# EAGLE design PIC24FJ64GB002+BT (EAGLE 6.2)
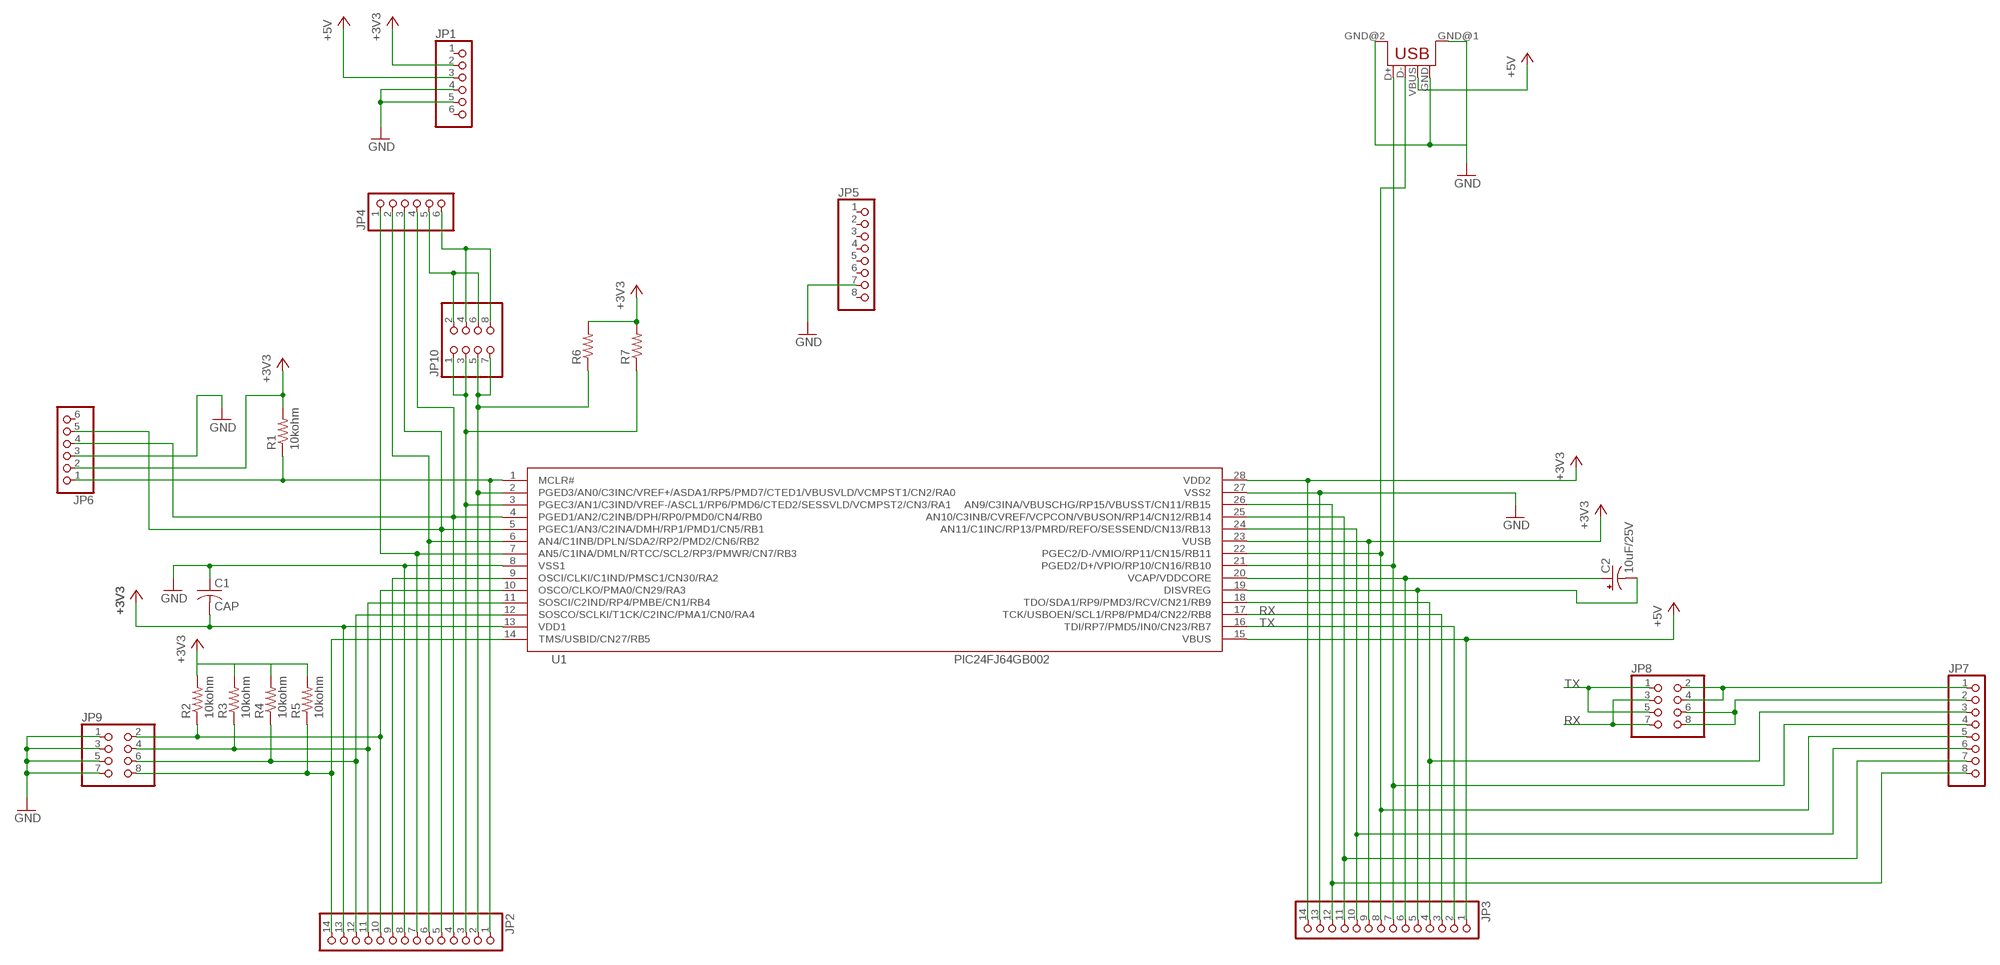
[diagram p0: schematic, sheet 1]

## Parts
C1  CAP  [C025-040X050]
C2  10uF/25V  CPOL-US  [CPOL-US]
CON1  USB  [USB-FEMALE-A-PTH]
JP1  PINHD-1X6  [1X06]
JP2  PINHD-1X14  [1X14]
JP3  PINHD-1X14  [1X14]
JP4  PINHD-1X6  [1X06]
JP5  PINHD-1X8  [1X08]
JP6  PINHD-1X6  [1X06]
JP7  PINHD-1X8  [1X08]
JP8  PINHD-2X4  [2X04]
JP9  PINHD-2X4  [2X04]
JP10  PINHD-2X4  [2X04]
R1  10kohm  R-US-01  [0204V]
R2  10kohm  R-US-01  [0204V]
R3  10kohm  R-US-01  [0204V]
R4  10kohm  R-US-01  [0204V]
R5  10kohm  R-US-01  [0204V]
R6  R-US-01  [0204V]
R7  R-US-01  [0204V]
U1  PIC24FJ64GB002  [DIP28]

## Nets
+3V3: C1.2 JP1.2 JP2.13 JP3.9 JP3.14 JP6.2 R1.2 R2.2 R3.2 R4.2 R5.2 R6.2 R7.2 U1.13(VDD1) U1.23(VUSB) U1.28(VDD2)
+5V: CON1.VBUS JP1.3 JP3.1 U1.15(VBUS)
GND: C1.1 CON1.GND CON1.GND@1(GND) CON1.GND@2(GND) JP1.4 JP1.5 JP2.8 JP3.13 JP5.7 JP6.3 JP9.1 JP9.3 JP9.5 JP9.7 U1.8(VSS1) U1.27(VSS2)
N$1: JP2.1 JP6.1 R1.1 U1.1(MCLR#)
N$2: C2.+ JP3.6 U1.20(VCAP/VDDCORE)
N$3: C2.- JP3.5 U1.19(DISVREG)
N$4: JP2.4 JP4.4 JP6.4 U1.4(PGED1/AN2/C2INB/DPH/RP0/PMD0/CN4/RB0)
N$5: JP2.5 JP4.3 JP6.5 U1.5(PGEC1/AN3/C2INA/DMH/RP1/PMD1/CN5/RB1)
N$6: JP2.2 JP10.5 JP10.7 R6.1 U1.2(PGED3/AN0/C3INC/VREF+/ASDA1/RP5/PMD7/CTED1/VBUSVLD/VCMPST1/CN2/RA0)
N$7: JP2.3 JP10.1 JP10.3 R7.1 U1.3(PGEC3/AN1/C3IND/VREF-/ASCL1/RP6/PMD6/CTED2/SESSVLD/VCMPST2/CN3/RA1)
N$8: JP2.6 JP4.2 U1.6(AN4/C1INB/DPLN/SDA2/RP2/PMD2/CN6/RB2)
N$9: JP2.7 JP4.1 U1.7(AN5/C1INA/DMLN/RTCC/SCL2/RP3/PMWR/CN7/RB3)
N$10: JP2.9 U1.9(OSCI/CLKI/C1IND/PMSC1/CN30/RA2)
N$11: JP2.10 JP9.2 R2.1 U1.10(OSCO/CLKO/PMA0/CN29/RA3)
N$12: JP2.11 JP9.4 R3.1 U1.11(SOSCI/C2IND/RP4/PMBE/CN1/RB4)
N$13: JP2.12 JP9.6 R4.1 U1.12(SOSCO/SCLKI/T1CK/C2INC/PMA1/CN0/RA4)
N$14: JP2.14 JP9.8 R5.1 U1.14(TMS/USBID/CN27/RB5)
N$16: JP3.11 JP7.7 U1.25(AN10/C3INB/CVREF/VCPCON/VBUSON/RP14/CN12/RB14)
N$17: JP3.10 JP7.6 U1.24(AN11/C1INC/RP13/PMRD/REFO/SESSEND/CN13/RB13)
N$18: CON1.D- JP3.8 JP7.5 U1.22(PGEC2/D-/VMIO/RP11/CN15/RB11)
N$19: CON1.D+ JP3.7 JP7.4 U1.21(PGED2/D+/VPIO/RP10/CN16/RB10)
N$20: JP3.4 JP7.3 U1.18(TDO/SDA1/RP9/PMD3/RCV/CN21/RB9)
N$22: JP4.6 JP10.4 JP10.8
N$23: JP7.1 JP8.2 JP8.4
N$24: JP7.2 JP8.6 JP8.8
N$25: JP4.5 JP10.2 JP10.6
N$30: JP3.12 JP7.8 U1.26(AN9/C3INA/VBUSCHG/RP15/VBUSST/CN11/RB15)
RX: JP3.3 JP8.3 JP8.7 U1.17(TCK/USBOEN/SCL1/RP8/PMD4/CN22/RB8)
TX: JP3.2 JP8.1 JP8.5 U1.16(TDI/RP7/PMD5/IN0/CN23/RB7)
Unconnected: JP1.1 JP1.6 JP5.1 JP5.2 JP5.3 JP5.4 JP5.5 JP5.6 JP5.8 JP6.6

## Library data of the parts
C1 = kimai0827:CAP
C2 = kimai0827:CPOL-US
CON1 = STUNTAZ:USB: USB Connectors USB-FEMALE-A-PTH: Through hole Female Type A Connector
JP1 JP4 JP6 = pinhead:PINHD-1X6: PIN HEADER
JP2 JP3 = pinhead:PINHD-1X14: PIN HEADER
JP5 JP7 = pinhead:PINHD-1X8: PIN HEADER
JP8-JP10 = pinhead:PINHD-2X4: PIN HEADER
R1-R7 = kimai0827:R-US-01
U1 = kimai0827:PIC24FJ64GB002: PIC24FJ64GB002

## Board
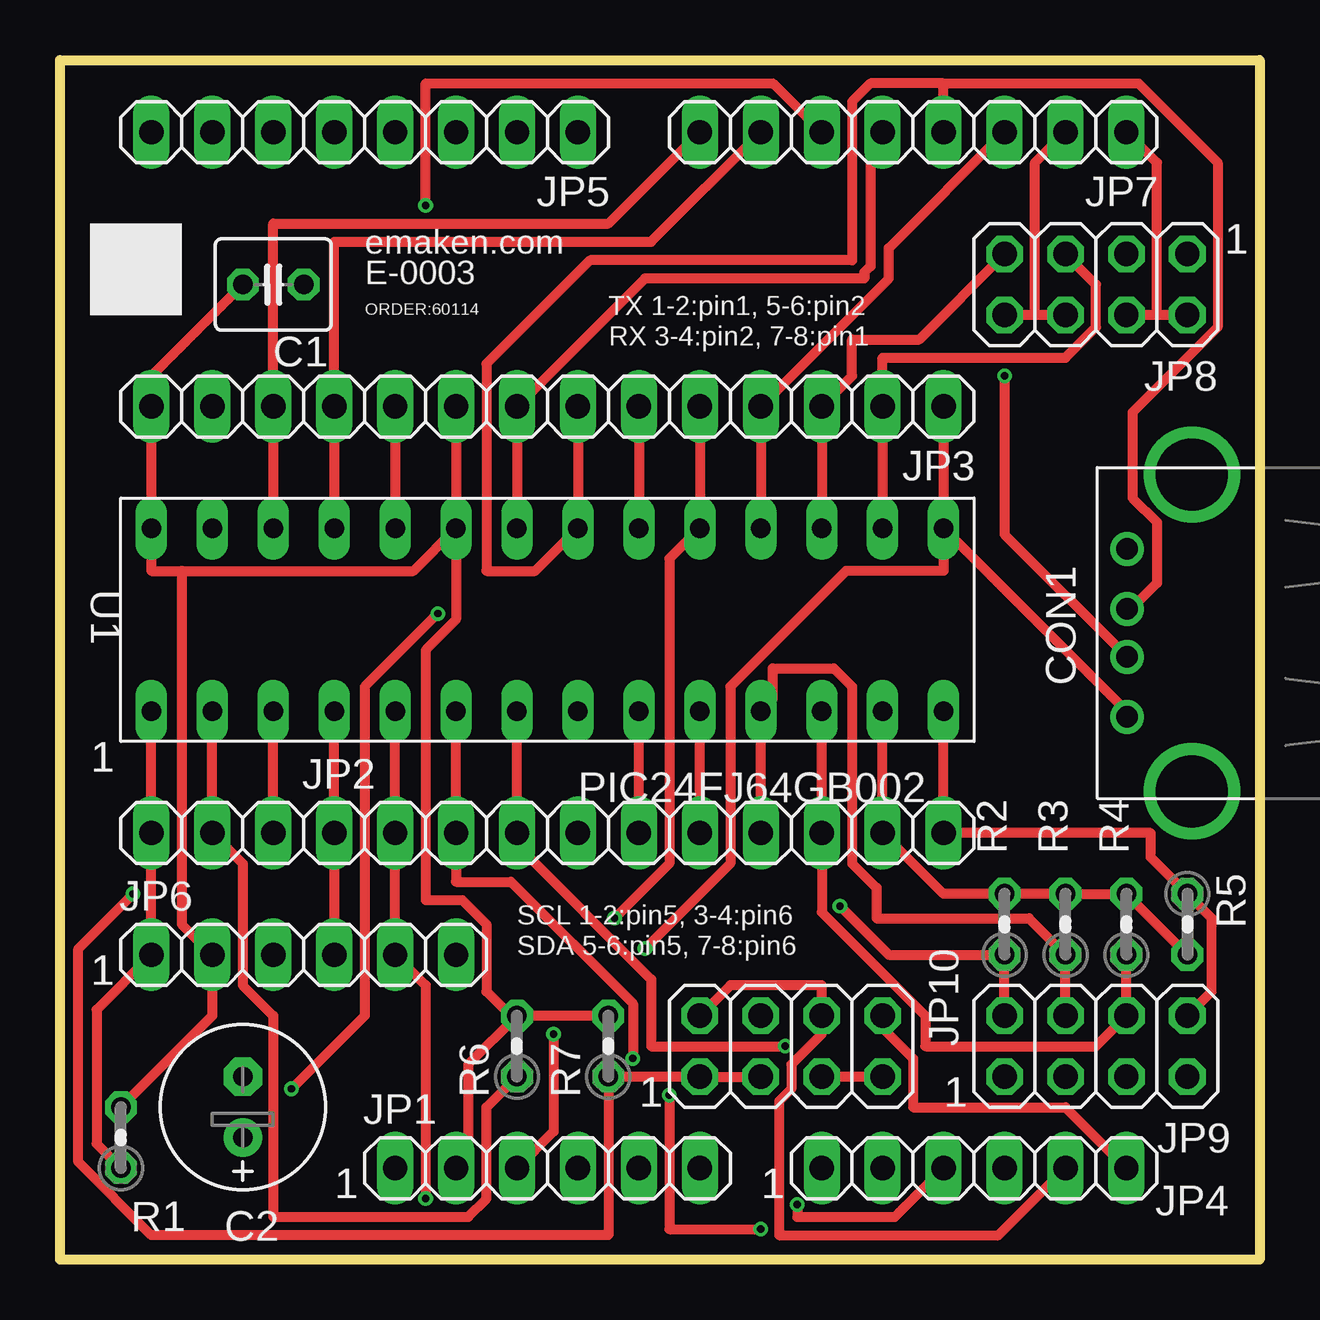
[diagram p1: board, top side]
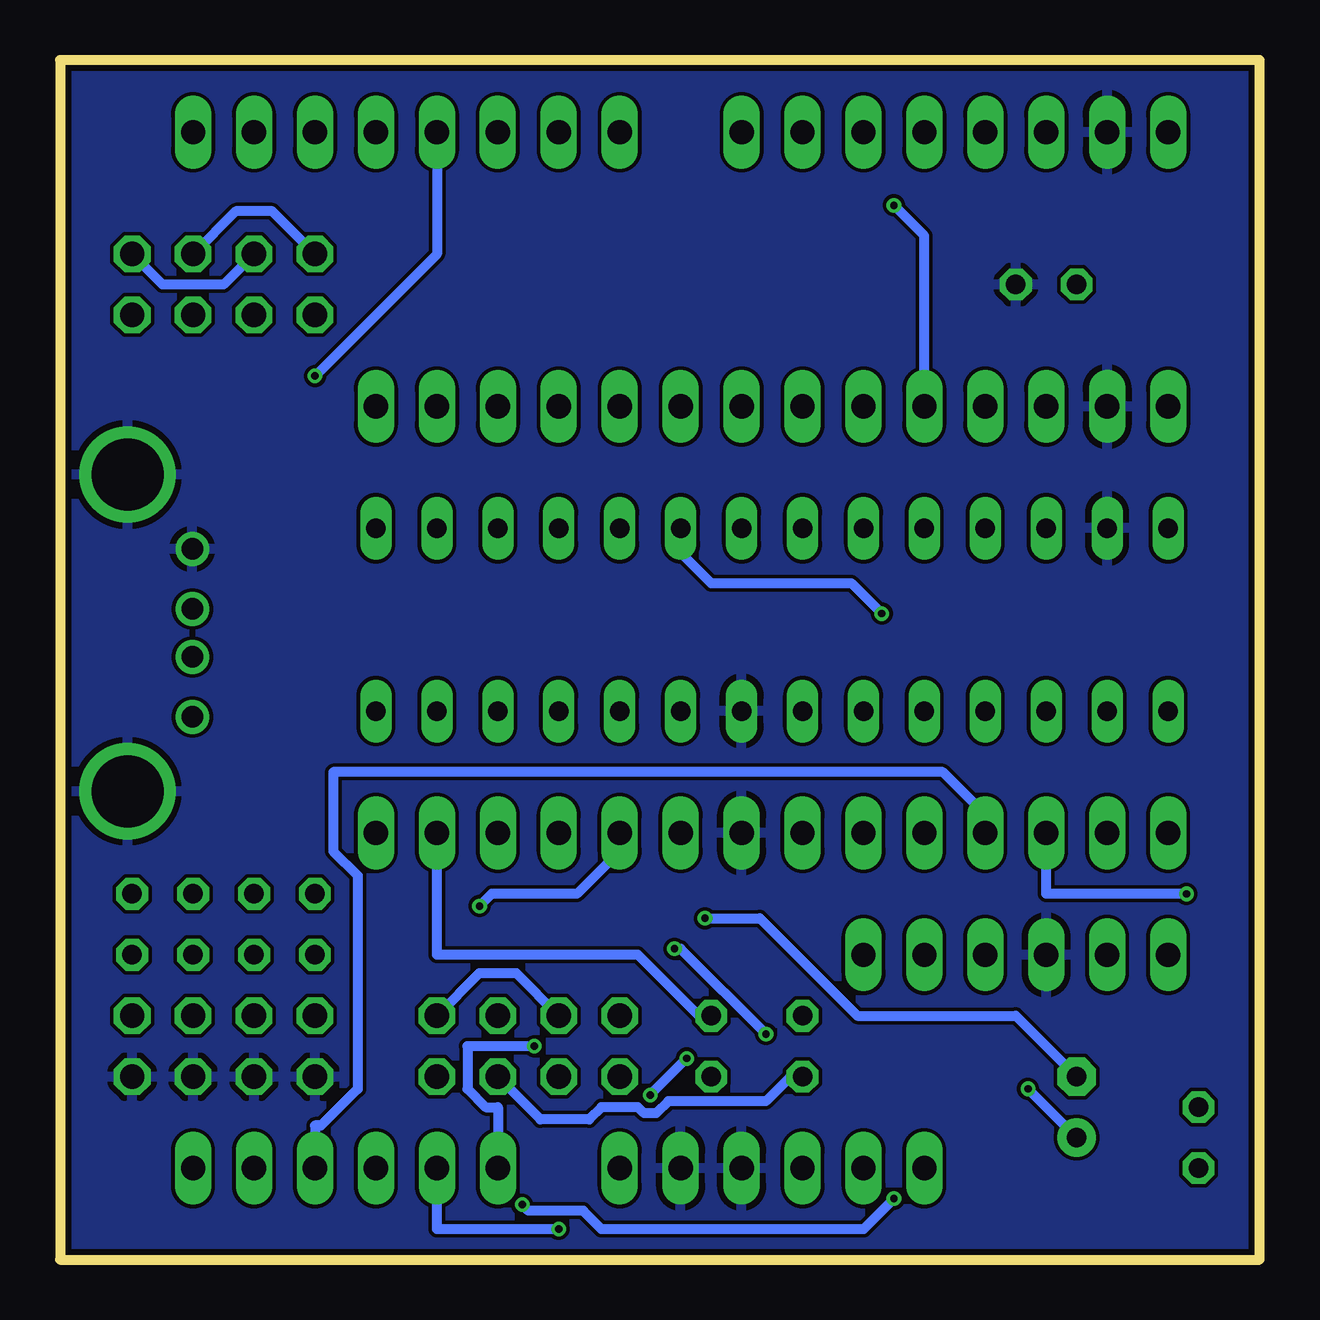
[diagram p2: board, bottom side, seen from below]

Size 50 x 50 mm. Coordinates in mm from the lower left corner, seen from the top.
Outline: 0,50 50,50 50,0 0,0 0,50
Copper layers (1*16): Top 0.035mm / dielectric 1.5mm / Bottom 0.035mm
Design rules: minimum track width 16mil, minimum drill 12mil, track to track 6mil, track to pad 6mil, pad to pad 6mil, via to via 6mil, smd to smd 0mil, copper to edge 10mil, drill to drill 10mil, minimum pad ring 10mil, minimum via ring 6mil, stop-mask expansion 2mil, vias tented up to drill 100mil, thermal gap 10mil

### Footprints (pad centres in the part's own frame; a part is rotated, then mirrored left to right if it is on the bottom)
C025-040X050 = drill 0.813 octagon: 1 0,0; 2 2.54,0
CPOL-US = drill 0.813 pad 1.6: + 0,0 | drill 0.813 pad 1.6 octagon: - 2.54,0
USB-FEMALE-A-PTH = drill 0.9: D+ 5.9,1.3; D- 7.9,1.3; GND 3.4,1.3; VBUS 10.4,1.3 | drill 3: GND@1 13.5,4; GND@2 0.3,4
1X06 = drill 1.016 long: 1 -6.35,0; 2 -3.81,0; 3 -1.27,0; 4 1.27,0; 5 3.81,0; 6 6.35,0
1X14 = drill 1.016 long: 1 -16.51,0; 2 -13.97,0; 3 -11.43,0; 4 -8.89,0; 5 -6.35,0; 6 -3.81,0; 7 -1.27,0; 8 1.27,0; 9 3.81,0; 10 6.35,0; 11 8.89,0; 12 11.43,0; 13 13.97,0; 14 16.51,0
1X08 = drill 1.016 long: 1 -8.89,0; 2 -6.35,0; 3 -3.81,0; 4 -1.27,0; 5 1.27,0; 6 3.81,0; 7 6.35,0; 8 8.89,0
2X04 = drill 1.016 octagon: 1 -3.81,-1.27; 2 -3.81,1.27; 3 -1.27,-1.27; 4 -1.27,1.27; 5 1.27,-1.27; 6 1.27,1.27; 7 3.81,-1.27; 8 3.81,1.27
0204V = drill 0.813 octagon: 1 0,0; 2 2.54,0
DIP28 = drill 0.813 long: 1 0,33.02; 2 0,30.48; 3 0,27.94; 4 0,25.4; 5 0,22.86; 6 0,20.32; 7 0,17.78; 8 0,15.24; 9 0,12.7; 10 0,10.16; 11 0,7.62; 12 0,5.08; 13 0,2.54; 14 0,0; 15 7.62,0; 16 7.62,2.54; 17 7.62,5.08; 18 7.62,7.62; 19 7.62,10.16; 20 7.62,12.7; 21 7.62,15.24; 22 7.62,17.78; 23 7.62,20.32; 24 7.62,22.86; 25 7.62,25.4; 26 7.62,27.94; 27 7.62,30.48; 28 7.62,33.02

### Placement (x,y rotation side)
C1  10.16,40.64 180 top
C2  7.62,5.08 90 top
CON1  43.18,33.02 270 top
JP1  20.32,3.81 0 top
JP2  20.32,17.78 0 top
JP3  20.32,35.56 180 top
JP4  38.1,3.81 0 top
JP5  12.7,46.99 180 top
JP6  10.16,12.7 0 top
JP7  35.56,46.99 180 top
JP8  43.18,40.64 180 top
JP9  43.18,8.89 0 top
JP10  30.48,8.89 0 top
R1  2.54,3.81 90 top
R2  39.37,12.7 90 top
R3  41.91,12.7 90 top
R4  44.45,12.7 90 top
R5  46.99,15.24 270 top
R6  19.05,7.62 90 top
R7  22.86,7.62 90 top
U1  36.83,22.86 90 top

### Tracks (layer width: path | path; a pad name or v marks a point on that pad's centre or on a via)
+3V3
  Top 0.406: U1.13 JP2.13 36.83,15.24 R2.2 R3.2 R4.2 R5.2 | R7.2 R6.2 | JP1.2 17.02,4.32 17.02,8.13 R6.2 | R1.2 6.35,10.16 JP6.2 5.08,13.97 5.08,28.7 | JP3.9 U1.23 | C1.2 3.81,36.83 JP3.14 U1.28 3.81,28.7 5.08,28.7 | U1.23 14.73,28.7 5.08,28.7 | U1.23 16.51,26.67 15.24,25.4 15.24,14.99 16.76,14.99 17.78,13.97 17.78,11.18 18.8,10.16 R6.2
  Bottom 0.406: JP2.13 34.29,12.7 25.91,12.7 23.37,10.16 R7.2
+5V  (via drill 0.3)
  Top 0.406: JP3.1 U1.15 | U1.15 44.45,22.86 CON1.VBUS | JP1.3 20.57,5.33 v20.57,9.4 | v24.38,12.95 27.94,16.51 27.94,23.88 32.77,28.7 36.83,28.7 U1.15
  Bottom 0.406: v20.57,9.4 24.13,12.95 v24.38,12.95
GND
  pour Bottom: -1.27,50.8 50.8,50.8 50.8,-1.27 -1.27,-1.27
N$1
  Top 0.406: U1.1 JP2.1 JP6.1 1.52,10.41 1.52,4.83 R1.1
N$2  (via drill 0.3)
  Top 0.406: JP3.6 U1.20 | v9.65,7.11 12.7,10.16 12.7,23.88 v15.75,26.92
  Bottom 0.406: v9.65,7.11 C2.+ | v15.75,26.92 17.02,28.19 22.86,28.19 24.13,29.46 U1.20
N$3  (via drill 0.3)
  Top 0.406: JP3.5 U1.19 25.4,29.21 25.4,16.51 v23.11,14.22
  Bottom 0.406: C2.- 10.16,10.16 16.76,10.16 20.83,14.22 v23.11,14.22
N$4
  Top 0.406: U1.4 JP2.4 JP6.4
  Bottom 0.406: JP4.4 39.37,5.59 39.12,5.59 37.59,7.11 37.59,16 38.61,17.02 38.61,20.32 13.21,20.32 11.43,18.54 JP2.4
N$5  (via drill 0.3)
  Top 0.406: U1.5 JP2.5 JP6.5 15.24,11.43 v15.24,2.54 | JP4.3 34.8,1.78 30.73,1.78 v30.73,2.29
  Bottom 0.406: v30.73,2.29 30.48,2.03 28.19,2.03 27.43,1.27 16.51,1.27 v15.24,2.54
N$6
  Top 0.406: JP10.7 JP10.5 | R6.1 17.78,6.35 17.78,2.54 17.02,1.78 8.89,1.78 8.89,10.16 7.62,11.43 7.62,16.51 JP2.2 U1.2
  Bottom 0.406: JP10.5 29.97,5.84 27.94,5.84 27.43,6.35 25.91,6.35 25.65,6.1 25.15,6.1 24.64,6.6 20.57,6.6 19.56,7.62 R6.1
N$7  (via drill 0.3)
  Top 0.406: JP2.3 U1.3 | JP10.3 JP10.1 R7.1 22.86,1.02 3.81,1.02 0.76,4.06 0.76,12.95 v3.05,15.24
  Bottom 0.406: JP2.3 8.89,15.24 v3.05,15.24
N$8  (via drill 0.3)
  Top 0.406: U1.6 JP2.6 16.51,15.75 18.8,15.75 23.88,10.67 v23.88,8.38 | v29.21,1.27 25.4,1.27 v25.4,6.86
  Bottom 0.406: JP4.2 34.29,1.27 v29.21,1.27 | v23.88,8.38 v25.4,6.86
N$9  (via drill 0.3)
  Top 0.406: U1.7 JP2.7 19.05,17.27 24.64,11.68 24.64,8.89 v30.23,8.89
  Bottom 0.406: JP4.1 31.75,6.35 32.26,6.35 33.02,7.11 33.02,8.89 v30.23,8.89
N$10
  Top 0.406: JP2.9 U1.9
N$11  (via drill 0.3)
  Top 0.406: JP9.2 R2.1 34.54,12.7 v32.51,14.73 | JP2.10 U1.10
  Bottom 0.406: v32.51,14.73 32,15.24 28.45,15.24 26.67,17.02 JP2.10
N$12
  Top 0.406: JP9.4 R3.1 40.39,14.22 34.04,14.22 34.04,15.49 33.02,16.51 33.02,23.88 32.26,24.64 29.72,24.64 29.72,23.37 U1.11 JP2.11
N$13
  Top 0.406: R4.1 JP9.6 43.18,8.89 36.07,8.89 36.07,10.16 31.75,14.48 JP2.12 U1.12
N$14
  Top 0.406: U1.14 JP2.14 45.47,17.78 45.47,16.76 R5.1 48.01,14.22 48.01,11.18 JP9.8
N$16
  Top 0.406: U1.25 JP3.11 11.43,42.42 24.64,42.42 JP7.7
N$17  (via drill 0.3)
  Top 0.406: JP3.10 U1.24 | JP7.6 29.72,49.02 15.24,49.02 v15.24,43.94
  Bottom 0.406: v15.24,43.94 13.97,42.67 JP3.10
N$18  (via drill 0.3)
  Top 0.406: U1.22 JP3.8 24.38,40.89 33.53,40.89 33.53,41.15 33.78,41.4 33.78,46.48 JP7.5 | v39.37,36.83 39.37,30.23 44.45,25.15 CON1.D-
  Bottom 0.406: v39.37,36.83 34.29,41.91 JP7.5
N$19
  Top 0.406: JP3.7 U1.21 19.81,28.7 17.78,28.7 17.78,37.34 22.1,41.66 33.02,41.66 33.02,48.26 33.78,49.02 36.83,49.02 | 36.83,49.02 44.96,49.02 48.26,45.72 48.26,38.86 44.7,35.31 44.7,31.75 45.72,30.73 45.72,28.19 44.7,27.18 CON1.D+ | JP7.4 36.83,49.02
N$20
  Top 0.406: U1.18 JP3.4 34.54,40.89 34.54,42.16 JP7.3
N$22
  Top 0.406: JP4.6 41.91,6.35 35.56,6.35 35.56,8.38 34.29,9.65 JP10.8
  Bottom 0.406: JP10.4 30.99,11.94 32.51,11.94 JP10.8
N$23
  Top 0.406: JP8.2 45.72,39.37 | 45.72,39.37 JP8.4 | JP7.1 45.72,45.72 45.72,39.37
N$24
  Top 0.406: JP8.6 40.64,39.37 | 40.64,39.37 JP8.8 | JP7.2 40.64,45.72 40.64,39.37
N$25
  Top 0.406: JP10.2 27.94,11.43 31.75,11.43 JP10.6 31.75,9.4 30.48,8.13 30.48,7.11 29.97,6.6 29.97,1.02 39.12,1.02 JP4.5
N$30
  Top 0.406: U1.26 JP3.12 8.89,43.18 22.86,43.18 JP7.8
RX
  Top 0.406: U1.17 JP3.3 33.02,36.83 33.02,38.35 35.81,38.35 JP8.7
  Bottom 0.406: JP8.3 42.67,43.69 41.15,43.69 JP8.7
TX
  Top 0.406: U1.16 JP3.2 34.29,37.59 41.91,37.59 43.18,38.86 43.18,40.64 JP8.5
  Bottom 0.406: JP8.1 45.72,40.64 43.18,40.64 JP8.5

### Text on the board
tPlace: emaken.com | E-0003 | ORDER:60114 | TX 1-2:pin1, 5-6:pin2 | RX 3-4:pin2, 7-8:pin1 | SCL 1-2:pin5, 3-4:pin6 | SDA 5-6:pin5, 7-8:pin6